# EAGLE schematic ArduInterface (EAGLE 7.6.0)
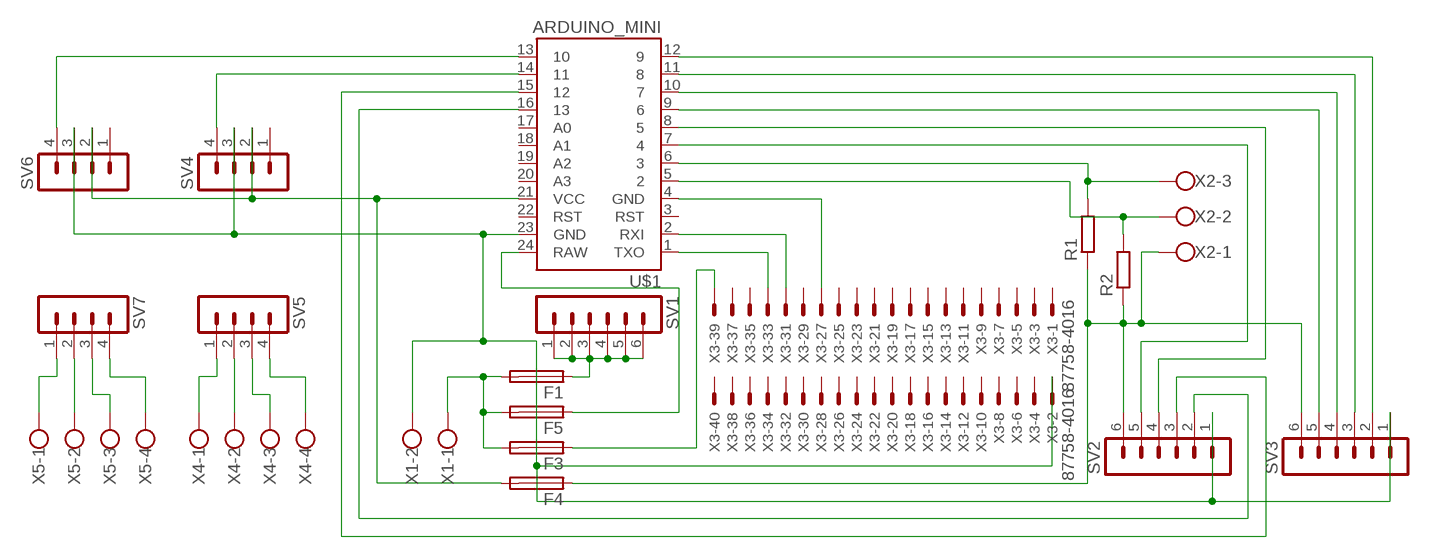
[diagram p0: schematic, sheet 1]

## Parts
F1  GSH15  [GSH15]
F3  GSH15  [GSH15]
F4  GSH15  [GSH15]
F5  GSH15  [GSH15]
R1  R-EU_0204/7  [0204/7]
R2  R-EU_0204/7  [0204/7]
SV1  MA06-1  [MA06-1]
SV2  MA06-1  [MA06-1]
SV3  MA06-1  [MA06-1]
SV4  MA04-1  [MA04-1]
SV5  MA04-1  [MA04-1]
SV6  MA04-1  [MA04-1]
SV7  MA04-1  [MA04-1]
U$1  ARDUINO_MINI  [ARDUINO_MINI]
X1  W237-102  [W237-102]
X2  W237-103  [W237-103]
X3  87758-4016  [87758-4016]
X4  W237-4  [W237-4]
X5  W237-4  [W237-4]

## Nets
N$1: SV3.5 U$1.9
N$2: SV6.4 U$1.13
N$3: SV4.4 U$1.14
N$4: SV2.2 U$1.16
N$5: SV2.3 U$1.15
N$6: SV2.5 U$1.7
N$7: SV2.4 U$1.8
N$8: SV3.4 U$1.10
N$9: SV3.3 U$1.11
N$10: SV3.2 U$1.12
N$11: F3.1 X3.39
N$12: F4.2 SV4.2 SV6.2 U$1.21(VCC)
N$13: R1.2 U$1.6 X2.3
N$14: SV5.1 X4.1
N$15: F4.1 R1.1 SV3.6 X2.1
N$17: U$1.1(TXO) X3.33
N$18: U$1.2(RXI) X3.31
N$19: F1.2 F3.2 F5.2 X1.1
N$20: U$1.4(GND) X3.27
N$21: F1.1 SV1.1 SV1.2 SV1.3 SV1.4 SV1.5 SV1.6
N$22: SV5.4 X4.4
N$23: F5.1 U$1.24(RAW)
N$24: R2.1 SV2.6
N$25: R2.2 U$1.5 X2.2
N$26: SV5.2 X4.2
N$27: SV5.3 X4.3
N$28: SV7.1 X5.1
N$29: SV7.2 X5.2
N$30: SV7.3 X5.3
N$31: SV7.4 X5.4
N$33: SV2.1 SV3.1 SV4.3 SV6.3 U$1.23(GND) X1.2 X3.2
Unconnected: SV4.1 SV6.1 U$1.3(RST) U$1.17(A0) U$1.18(A1) U$1.19(A2) U$1.20(A3) U$1.22(RST) X3.1 X3.3 X3.4 X3.5 X3.6 X3.7 X3.8 X3.9 X3.10 X3.11 X3.12 X3.13 X3.14 X3.15 X3.16 X3.17 X3.18 X3.19 X3.20 X3.21 X3.22 X3.23 X3.24 X3.25 X3.26 X3.28 X3.29 X3.30 X3.32 X3.34 X3.35 X3.36 X3.37 X3.38 X3.40

## Library data of the parts
F1 F3-F5 = fuse:GSH15: FUSE HOLDER grid 15mm, 19649 Wickmann; MPN: 64900001039; OC_FARNELL: 1271673; OC_NEWARK: 02P0318
R1 R2 = resistor:R-EU_: RESISTOR, European symbol
SV1-SV3 = con-lstb:MA06-1: PIN HEADER; OC_FARNELL: unknown; OC_NEWARK: unknown
SV4-SV7 = con-lstb:MA04-1: PIN HEADER; OC_FARNELL: unknown; OC_NEWARK: unknown
U$1 = SparkFun-Boards:ARDUINO_MINI: Arduino Pro Mini footprint
X1 = con-wago-500:W237-102: WAGO SCREW CLAMP; MPN: 237-102; OC_FARNELL: unknown; OC_NEWARK: 70K9898
X2 = con-wago-500:W237-103: WAGO SCREW CLAMP; MPN: 237-103; OC_FARNELL: unknown; OC_NEWARK: 18M7116
X3 = con-molex:87758-4016: 40 Pin - 2mm Dual Row Single Wafer, Vertical T/H HDR Source: http://www.molex.com/pdm_docs/sd/877580616_sd.pdf; MPN: 87758-4016; OC_FARNELL: unknown; OC_NEWARK: 25M5691
X4 X5 = con-wago-500:W237-4: WAGO SCREW CLAMP; OC_FARNELL: unknown; OC_NEWARK: unknown